# Altium schematic sheet WS2812B.SchDoc
size A4; SheetNumber: 14; SheetTotal: 15
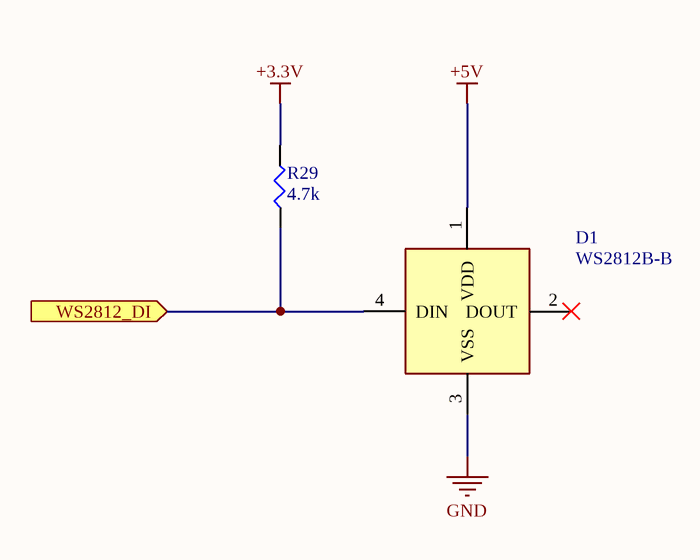
[diagram p0: WS2812B.SchDoc]

## Parts
D1  WS2812B-B  [WS2812BB]
R29  4.7k  [SMD-0402-RES]

## Ports
WS2812_DI (in)

## Nets
+3.3V: R29.2
+5V: D1.1(VDD)
GND: D1.3(VSS)
WS2812_DI: D1.4(DIN) R29.1 ; port WS2812_DI

Not connected (* = marked no-connect by the designer): D1 2(DOUT)*

## Library data of the parts
D1 = WS2812B-B: LED; Manufacturer_Name: Worldsemi; Datasheet Link: http://www.world-semi.com/DownLoadFile/111; Height: 1.62mm; Manufacturer_Part_Number: WS2812B-B; Value: WS2812B-B
R29 = ERJ-2RKF4701X: RES SMD 4.7K OHM 1% 1/10W 0402; Manufacturer: Panasonic Electronic Components; Factory Stock: 0; Unit Price (USD): 0.00496; @ qty: 1500; Minimum Quantity: 1; Power (Watts): 0.1W, 1/10W; Temperature Coefficient: ±100ppm/°C; Part Number: ERJ-2RKF4701X; Datasheets: http://industrial.panasonic.com/www-cgi/jvcr13pz.cgi?E+PZ+3+AOA0002+ERJ2RKF4701X+7+WW; Image: //media.digikey.com/Photos/Panasonic%20Photos/ERJ-PA2-Series.jpg; Digi-Key Part Number: P4.70KLCT-ND; Quantity Available: 1881807; Packaging: Cut Tape (CT); Series: ERJ; Part Status: Active; Value: 4.7k; Tolerance: ±1%; Composition: Thick Film; Features: Automotive AEC-Q200; Operating Temperature: -55°C ~ 155°C; Package / Case: 0402 (1005 Metric); Supplier Device Package: 0402; Size / Dimension: 0.039" L x 0.020" W (1.00mm x 0.50mm); Height - Seated (Max): 0.016" (0.40mm); Number of Terminations: 2; Failure Rate: -